# Altium schematic sheet 20.SchDoc
size 297 x 209 mm
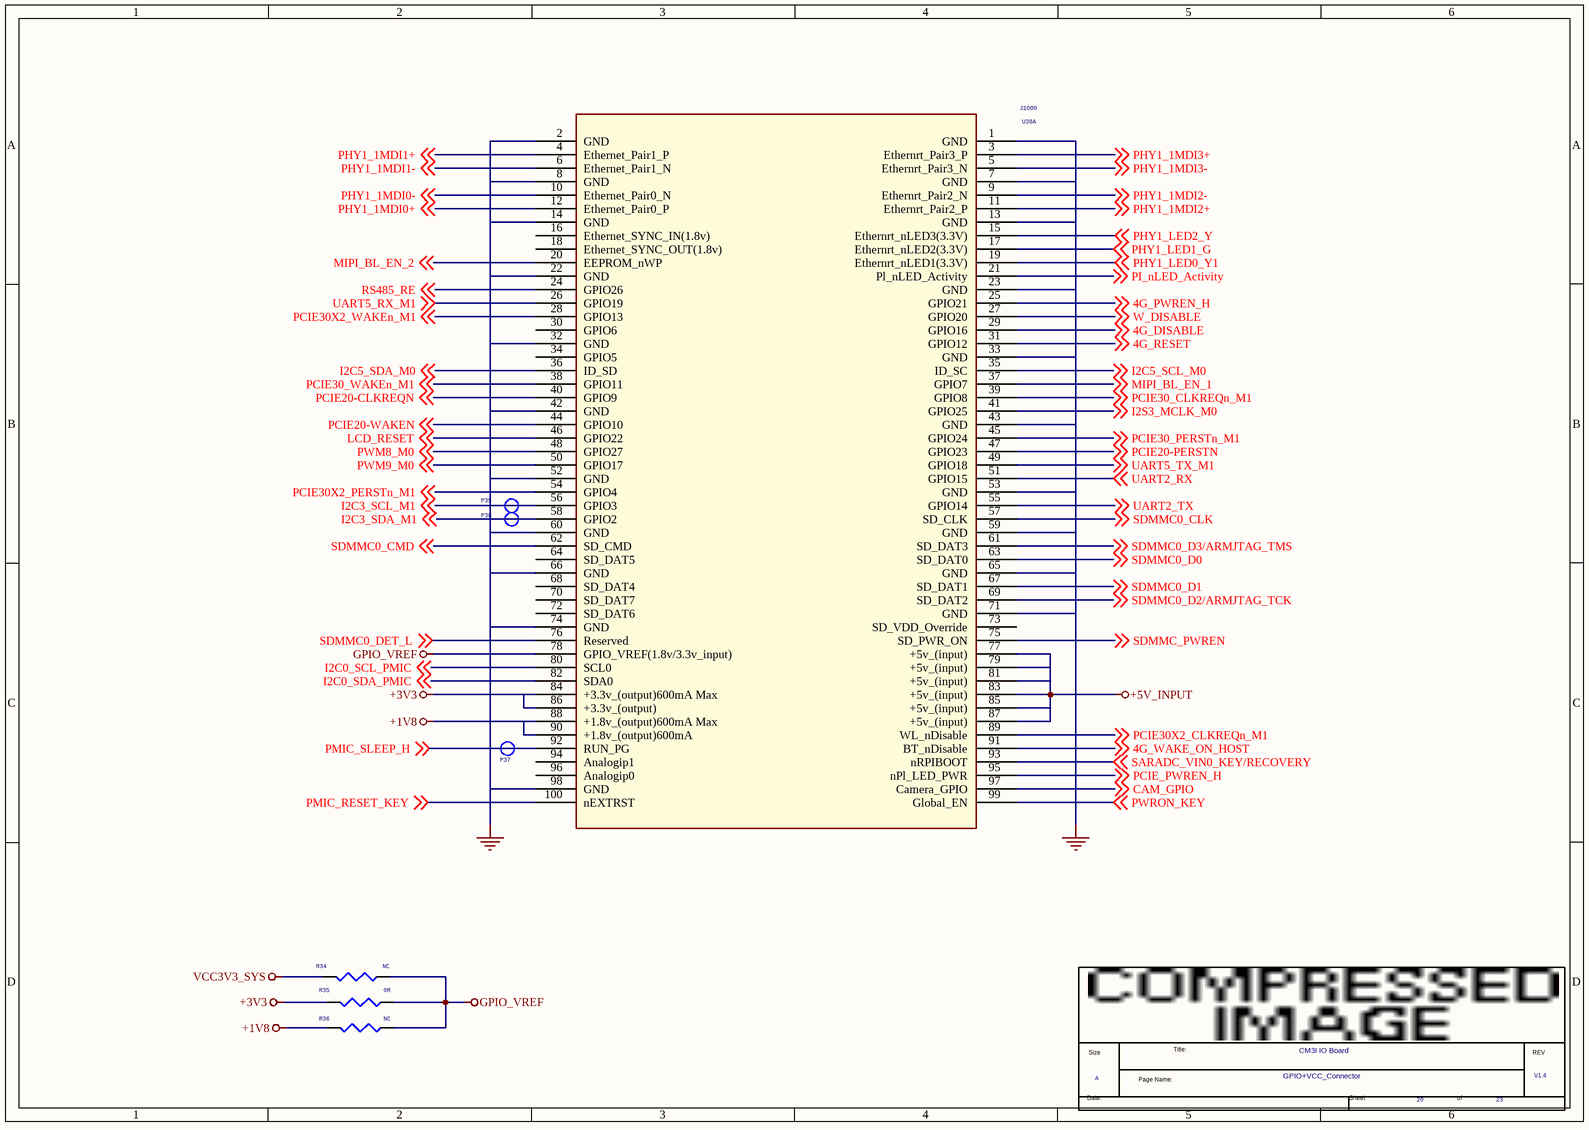
[diagram p0: 20.SchDoc]

## Parts
*  Page Count: 23  Page Number: 20  Page Size: A  Title: CM3I IO Board  RevCode: V1.4  Doc: GPIO+VCC_Connector  (hidden comment: radxa_1010)  (graphical)
P35  TEST  [TEST]  (value not drawn)
P36  TEST  [TEST]  (value not drawn)
P37  TEST  [TEST]  (value not drawn)
R34  NC  [R0402]
R35  0R  [R0402]
R36  NC  [R0402]
U38  J1000  [DF40C-200DS-70X40_MZ_3D5]  (part A of 2)

## Nets
+1V8: R36.2 U38.88(+1.8v_(output)600mA_Max) U38.90(+1.8v_(output)600mA)
+3V3: R35.2 U38.84(+3.3v_(output)600mA_Max) U38.86(+3.3v_(output))
+5V_INPUT: U38.77(+5v_(input)) U38.79(+5v_(input)) U38.81(+5v_(input)) U38.83(+5v_(input)) U38.85(+5v_(input)) U38.87(+5v_(input))
GND: U38.1(GND) U38.2(GND) U38.7(GND) U38.8(GND) U38.13(GND) U38.14(GND) U38.22(GND) U38.23(GND) U38.32(GND) U38.33(GND) U38.42(GND) U38.43(GND) U38.52(GND) U38.53(GND) U38.59(GND) U38.60(GND) U38.65(GND) U38.66(GND) U38.71(GND) U38.74(GND) U38.98(GND)
GPIO_VREF: R34.1 R35.1 R36.1 U38.78(GPIO_VREF(1.8v/3.3v_input))
VCC3V3_SYS: R34.2
4G_DISABLE: U38.29(GPIO16) ; off-sheet 4G_DISABLE
4G_PWREN_H: U38.25(GPIO21) ; off-sheet 4G_PWREN_H
4G_RESET: U38.31(GPIO12) ; off-sheet 4G_RESET
4G_WAKE_ON_HOST: U38.91(BT_nDisable) ; off-sheet 4G_WAKE_ON_HOST
CAM_GPIO: U38.97(Camera_GPIO) ; off-sheet CAM_GPIO
I2C0_SCL_PMIC: U38.80(SCL0) ; off-sheet I2C0_SCL_PMIC
I2C0_SDA_PMIC: U38.82(SDA0) ; off-sheet I2C0_SDA_PMIC
I2C3_SCL_M1: P35.1 U38.56(GPIO3) ; off-sheet I2C3_SCL_M1
I2C3_SDA_M1: P36.1 U38.58(GPIO2) ; off-sheet I2C3_SDA_M1
I2C5_SCL_M0: U38.35(ID_SC) ; off-sheet I2C5_SCL_M0
I2C5_SDA_M0: U38.36(ID_SD) ; off-sheet I2C5_SDA_M0
I2S3_MCLK_M0: U38.41(GPIO25) ; off-sheet I2S3_MCLK_M0
LCD_RESET: U38.46(GPIO22) ; off-sheet LCD_RESET
MIPI_BL_EN_1: U38.37(GPIO7) ; off-sheet MIPI_BL_EN_1
MIPI_BL_EN_2: U38.20(EEPROM_nWP) ; off-sheet MIPI_BL_EN_2
PCIE20-CLKREQN: U38.40(GPIO9) ; off-sheet PCIE20-CLKREQN
PCIE20-PERSTN: U38.47(GPIO23) ; off-sheet PCIE20-PERSTN
PCIE20-WAKEN: U38.44(GPIO10) ; off-sheet PCIE20-WAKEN
PCIE30_CLKREQn_M1: U38.39(GPIO8) ; off-sheet PCIE30_CLKREQn_M1
PCIE30_PERSTn_M1: U38.45(GPIO24) ; off-sheet PCIE30_PERSTn_M1
PCIE30_WAKEn_M1: U38.38(GPIO11) ; off-sheet PCIE30_WAKEn_M1
PCIE30X2_CLKREQn_M1: U38.89(WL_nDisable) ; off-sheet PCIE30X2_CLKREQn_M1
PCIE30X2_PERSTn_M1: U38.54(GPIO4) ; off-sheet PCIE30X2_PERSTn_M1
PCIE30X2_WAKEn_M1: U38.28(GPIO13) ; off-sheet PCIE30X2_WAKEn_M1
PCIE_PWREN_H: U38.95(nPl_LED_PWR) ; off-sheet PCIE_PWREN_H
PHY1_1MDI0+: U38.12(Ethernet_Pair0_P) ; off-sheet PHY1_1MDI0+
PHY1_1MDI0-: U38.10(Ethernet_Pair0_N) ; off-sheet PHY1_1MDI0-
PHY1_1MDI1+: U38.4(Ethernet_Pair1_P) ; off-sheet PHY1_1MDI1+
PHY1_1MDI1-: U38.6(Ethernet_Pair1_N) ; off-sheet PHY1_1MDI1-
PHY1_1MDI2+: U38.11(Ethernrt_Pair2_P) ; off-sheet PHY1_1MDI2+
PHY1_1MDI2-: U38.9(Ethernrt_Pair2_N) ; off-sheet PHY1_1MDI2-
PHY1_1MDI3+: U38.3(Ethernrt_Pair3_P) ; off-sheet PHY1_1MDI3+
PHY1_1MDI3-: U38.5(Ethernrt_Pair3_N) ; off-sheet PHY1_1MDI3-
PHY1_LED0_Y1: U38.19(Ethernrt_nLED1(3.3V)) ; off-sheet PHY1_LED0_Y1
PHY1_LED1_G: U38.17(Ethernrt_nLED2(3.3V)) ; off-sheet PHY1_LED1_G
PHY1_LED2_Y: U38.15(Ethernrt_nLED3(3.3V)) ; off-sheet PHY1_LED2_Y
PI_nLED_Activity: U38.21(Pl_nLED_Activity) ; off-sheet PI_nLED_Activity
PMIC_RESET_KEY: U38.100(nEXTRST) ; off-sheet PMIC_RESET_KEY
PMIC_SLEEP_H: P37.1 U38.92(RUN_PG) ; off-sheet PMIC_SLEEP_H
PWM8_M0: U38.48(GPIO27) ; off-sheet PWM8_M0
PWM9_M0: U38.50(GPIO17) ; off-sheet PWM9_M0
PWRON_KEY: U38.99(Global_EN) ; off-sheet PWRON_KEY
RS485_RE: U38.24(GPIO26) ; off-sheet RS485_RE
SARADC_VIN0_KEY/RECOVERY: U38.93(nRPIBOOT) ; off-sheet SARADC_VIN0_KEY/RECOVERY
SDMMC0_CLK: U38.57(SD_CLK) ; off-sheet SDMMC0_CLK
SDMMC0_CMD: U38.62(SD_CMD) ; off-sheet SDMMC0_CMD
SDMMC0_D0: U38.63(SD_DAT0) ; off-sheet SDMMC0_D0
SDMMC0_D1: U38.67(SD_DAT1) ; off-sheet SDMMC0_D1
SDMMC0_D2/ARMJTAG_TCK: U38.69(SD_DAT2) ; off-sheet SDMMC0_D2/ARMJTAG_TCK
SDMMC0_D3/ARMJTAG_TMS: U38.61(SD_DAT3) ; off-sheet SDMMC0_D3/ARMJTAG_TMS
SDMMC0_DET_L: U38.76(Reserved) ; off-sheet SDMMC0_DET_L
SDMMC_PWREN: U38.75(SD_PWR_ON) ; off-sheet SDMMC_PWREN
UART2_RX: U38.51(GPIO15) ; off-sheet UART2_RX
UART2_TX: U38.55(GPIO14) ; off-sheet UART2_TX
UART5_RX_M1: U38.26(GPIO19) ; off-sheet UART5_RX_M1
UART5_TX_M1: U38.49(GPIO18) ; off-sheet UART5_TX_M1
W_DISABLE: U38.27(GPIO20) ; off-sheet W_DISABLE

Not connected (* = marked no-connect by the designer): U38 16(Ethernet_SYNC_IN(1.8v)) 18(Ethernet_SYNC_OUT(1.8v)) 30(GPIO6) 34(GPIO5) 64(SD_DAT5) 68(SD_DAT4) 70(SD_DAT7) 72(SD_DAT6) 73(SD_VDD_Override) 94(Analogip1) 96(Analogip0)

## Notes on the sheet
- (in symbol radxa_1010) Title:; Size; REV; Page Name:; Date:; Sheet; of

## Library data of the parts
P35-P37 = TESTPOINT1
R34-R36 = RESISTOR_0_Dup1: 通用厚膜电阻,100R,+/-5%,R0402,1/16W.; Manufacturer PN: RC0402JR-07100RL; Manufacturer: YAGEO; Tolerance: 5%; Wattage: 1/16W; Priority: A; Created by: YTL; Part Type: 通用厚膜电阻; RK PN: RC0402JR-07100RL
U38 = HETER_4
* = radxa_1010: Page Create Date: March  8, 1995